# EAGLE schematic sha2017_rev0_1_0_dev (EAGLE 6.6.0)
Assembly variants: PRODUCTION

## Sheet 1 of 5
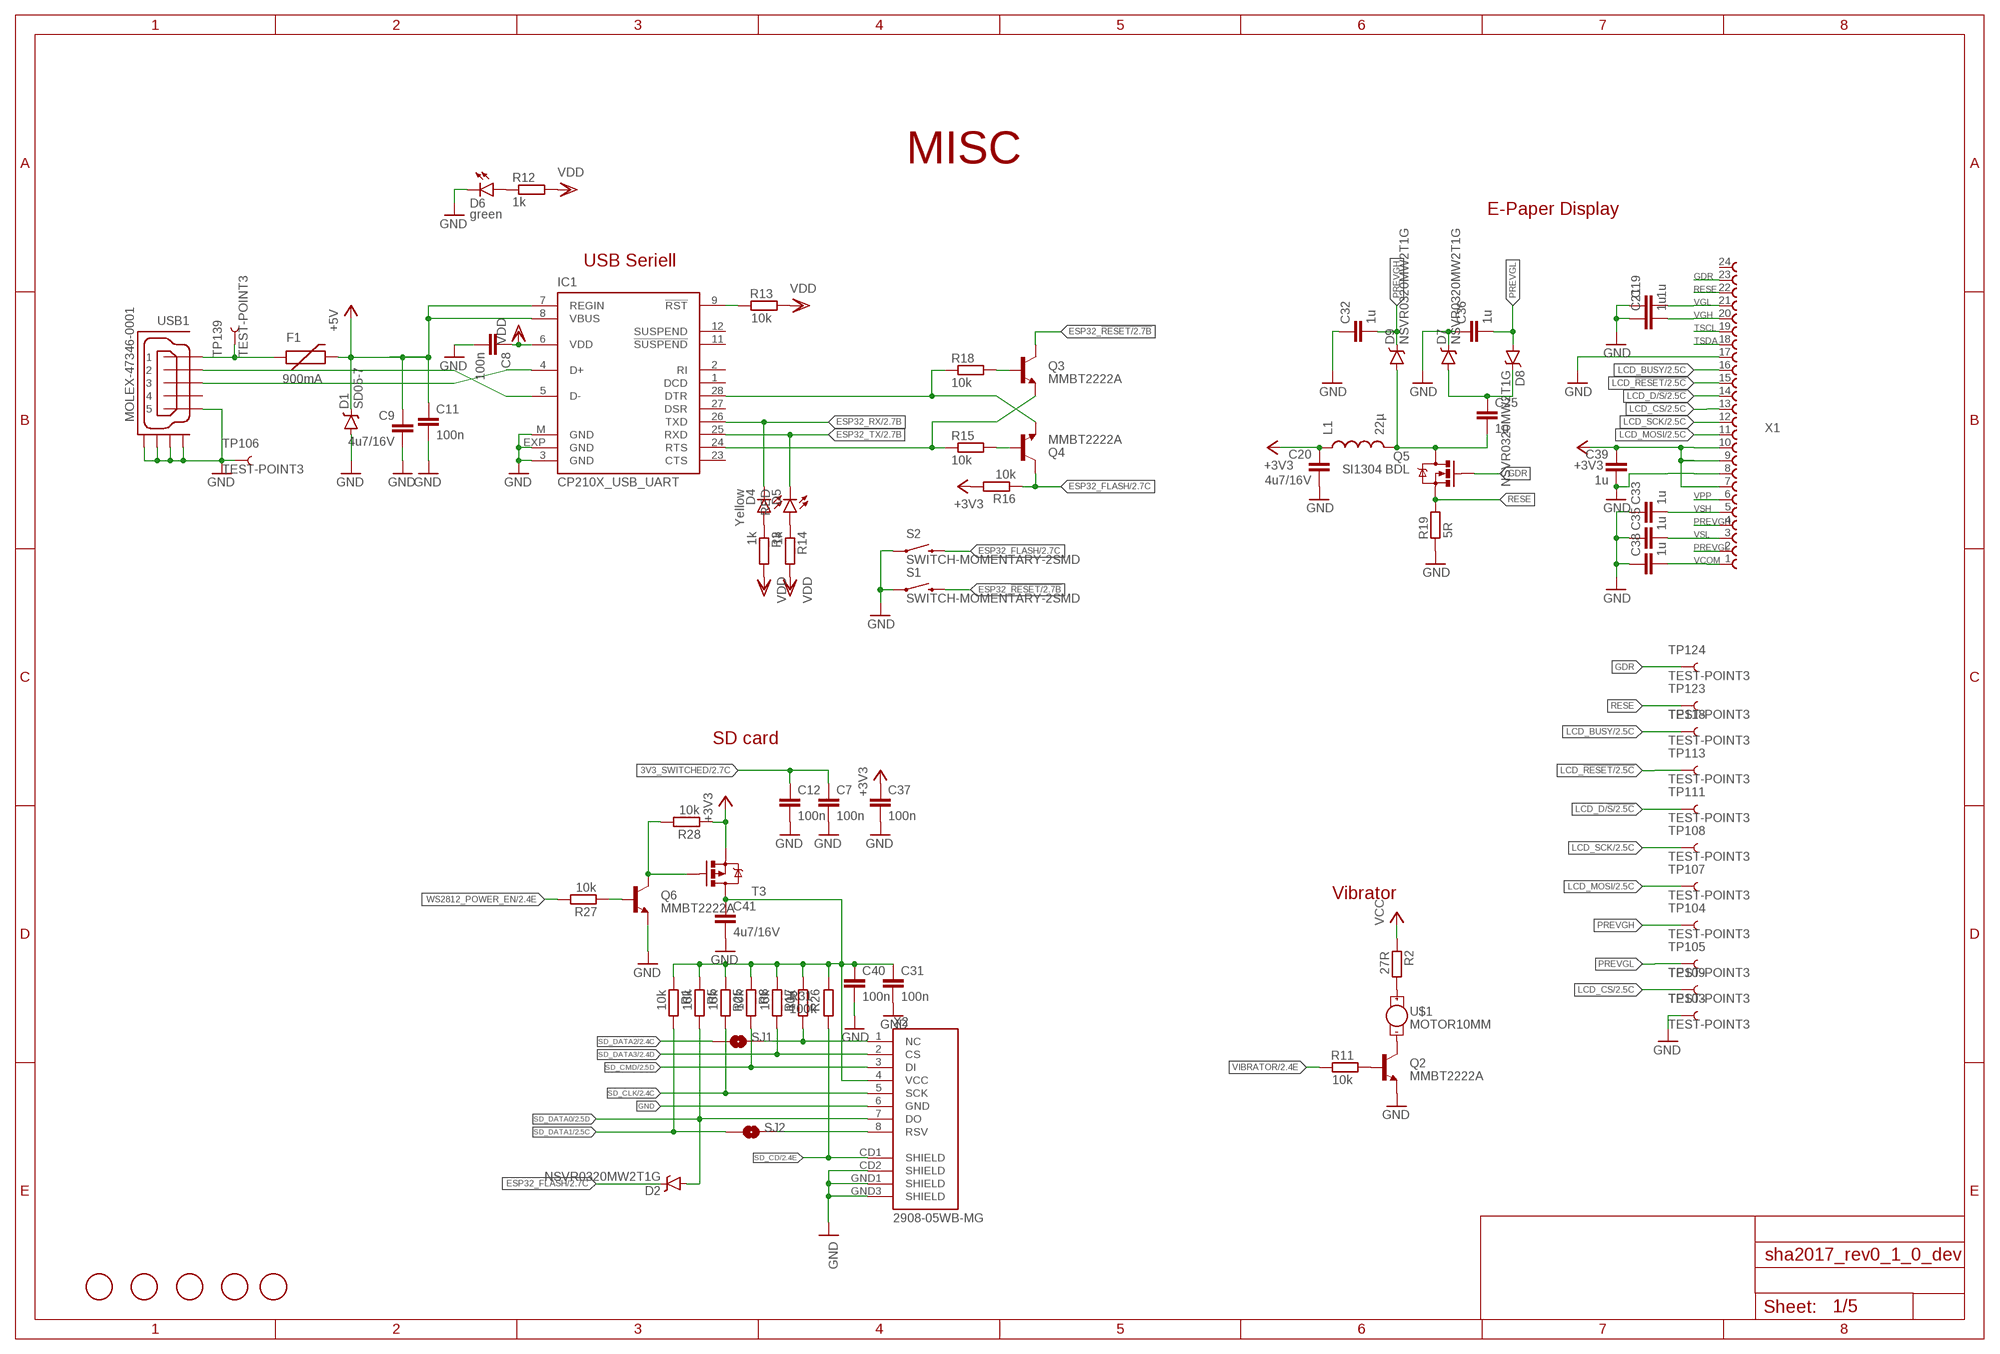
[diagram p0: schematic, sheet 1]

### Parts
C7  100n  C0603-DASHES  [C0603-DASHES]
C8  100n  C0603-DASHES  [C0603-DASHES]
C9  4u7/16V  C-EUC0805  [C0805]
C11  100n  C0603-DASHES  [C0603-DASHES]
C12  100n  C0603-DASHES  [C0603-DASHES]
C19  1u  C0603-DASHES  [C0603-DASHES]
C20  4u7/16V  C-EUC0805  [C0805]
C21  1u  C0603-DASHES  [C0603-DASHES]
C25  1u  C0603-DASHES  [C0603-DASHES]
C31  100n  C0603-DASHES  [C0603-DASHES]
C32  1u  C0603-DASHES  [C0603-DASHES]
C33  1u  C0603-DASHES  [C0603-DASHES]
C35  1u  C0603-DASHES  [C0603-DASHES]
C36  1u  C0603-DASHES  [C0603-DASHES]
C37  100n  C0603-DASHES  [C0603-DASHES]
C38  1u  C0603-DASHES  [C0603-DASHES]
C39  1u  C0603-DASHES  [C0603-DASHES]
C40  100n  C0603-DASHES  [C0603-DASHES]
C41  4u7/16V  C-EUC0805  [C0805]
D1  SD05-7  DIODE-SCHOTTKY-PMEG4005EJ  [SOD-323]
D2  NSVR0320MW2T1G  BAT20JFILM  [SOD-323]
D4  Yellow  LED0603  [LED-0603]
D5  RED  LED0603  [LED-0603]
D6  green  LED0603  [LED-0603]
D7  NSVR0320MW2T1G  BAT20JFILM  [SOD-323]
D8  NSVR0320MW2T1G  BAT20JFILM  [SOD-323]
D9  NSVR0320MW2T1G  BAT20JFILM  [SOD-323]
F1  900mA  PTCSMD  [PTC-1206]
FD1  FIDUCIAL  [FIDUCIAL_1MM]
FD2  FIDUCIAL  [FIDUCIAL_1MM]
FD3  FIDUCIAL  [FIDUCIAL_1MM]
FD4  FIDUCIAL  [FIDUCIAL_1MM]
FD5  FIDUCIAL  [FIDUCIAL_1MM]
IC1  CP210X_USB_UART  [MLP28]
L1  22µ  INDUCTOR1210  [1210]
Q2  MMBT2222A  TRANSISTOR_NPNMMBT2222A  [SOT23-3]
Q3  MMBT2222A  TRANSISTOR_NPNMMBT2222A  [SOT23-3]
Q4  MMBT2222A  TRANSISTOR_NPNMMBT2222A  [SOT23-3]
Q5  SI1304 BDL  MOSFET-NCHANNEL2N7002PW  [SOT323]
Q6  MMBT2222A  TRANSISTOR_NPNMMBT2222A  [SOT23-3]
R1  10k  R0603-DASHES  [R0603-DASHES]
R2  27R  R0603-DASHES  [R0603-DASHES]
R3  1k  R0603-DASHES  [R0603-DASHES]
R5  10k  R0603-DASHES  [R0603-DASHES]
R8  10k  R0603-DASHES  [R0603-DASHES]
R11  10k  R0603-DASHES  [R0603-DASHES]
R12  1k  R0603-DASHES  [R0603-DASHES]
R13  10k  R0603-DASHES  [R0603-DASHES]
R14  1k  R0603-DASHES  [R0603-DASHES]
R15  10k  R0603-DASHES  [R0603-DASHES]
R16  10k  R0603-DASHES  [R0603-DASHES]
R17  10k  R0603-DASHES  [R0603-DASHES]
R18  10k  R0603-DASHES  [R0603-DASHES]
R19  5R  R0603-DASHES  [R0603-DASHES]
R25  10k  R0603-DASHES  [R0603-DASHES]
R26  10k  R0603-DASHES  [R0603-DASHES]
R27  10k  R0603-DASHES  [R0603-DASHES]
R28  10k  R0603-DASHES  [R0603-DASHES]
R31  100k  R0603-DASHES  [R0603-DASHES]
S1  SWITCH-MOMENTARY-2SMD  [TACTILE-SWITCH-SMD]
S2  SWITCH-MOMENTARY-2SMD  [TACTILE-SWITCH-SMD]
SJ1  JUMPER-PAD-2-NOYES_SILK  [PAD-JUMPER-2-NO_YES_SILK]
SJ2  JUMPER-PAD-2-NOYES_SILK  [PAD-JUMPER-2-NO_YES_SILK]
T3  MOSFET-PCHANNEL  [SOT23-3]
TP103  TEST-POINT3  [PAD.03X.03]
TP104  TEST-POINT3  [PAD.03X.03]
TP105  TEST-POINT3  [PAD.03X.03]
TP106  TEST-POINT3  [PAD.03X.03]
TP107  TEST-POINT3  [PAD.03X.03]
TP108  TEST-POINT3  [PAD.03X.03]
TP109  TEST-POINT3  [PAD.03X.03]
TP111  TEST-POINT3  [PAD.03X.03]
TP113  TEST-POINT3  [PAD.03X.03]
TP118  TEST-POINT3  [PAD.03X.03]
TP123  TEST-POINT3  [PAD.03X.03]
TP124  TEST-POINT3  [PAD.03X.03]
TP139  TEST-POINT3  [PAD.03X.03]
U$1  MOTOR10MM  [VIBE-MOTOR-10MM]
USB1  MOLEX-47346-0001  [MOLEX-47364-0001]
X1  68712414022  [68712414022]
X2  2908-05WB-MG  [MICRO-SD-SOCKET-PP]  (not fitted in variant PRODUCTION)

### Nets
3V3_SWITCHED: C7.1 C12.1 C31.1 C40.1 C41.1 R1.2 R5.2 R8.2 R17.2 R25.2 R26.2 R31.1 T3.3(D) X2.4(VCC) ; also sheet 2
+3V3: C20.1 C37.1 C39.1 L1.1 R16.2 R28.2 T3.2(S) X1.7 X1.9 X1.10 ; also sheet 2,3,5
+5V [GND/3V3]: C9.1 C11.1 D1.C F1.2 IC1.7(REGIN) IC1.8(VBUS) ; also sheet 2,3
ESP32_!RESET: Q3.3(C) S1.3 ; also sheet 2
ESP32_FLASH: D2.C Q4.3(C) R16.1 S2.3 ; also sheet 2
ESP32_RX: D4.C IC1.26(TXD) ; also sheet 2
ESP32_TX: D5.C IC1.25(RXD) ; also sheet 2
GDR: Q5.1(G) TP124.P$1 X1.23
GND [GND/3V3]: C7.2 C8.2 C9.2 C11.2 C12.2 C19.1 C20.2 C21.1 C31.2 C32.1 C33.1 C35.1 C36.1 C37.2 C38.1 C39.2 C40.2 C41.2 D1.A D6.C D7.C IC1.3(GND) IC1.EXP(GND) IC1.M(GND) Q2.2(E) Q6.2(E) R19.2 S1.1 S2.1 TP103.P$1 TP106.P$1 USB1.5 USB1.GND1 USB1.GND2 USB1.GND3 USB1.GND4 X1.8 X1.17 X2.6(GND) X2.CD2(SHIELD) X2.GND1(SHIELD) X2.GND3(SHIELD) ; also sheet 2,3,4,5
LCD_!RESET: TP113.P$1 X1.15 ; also sheet 2
LCD_BUSY: TP118.P$1 X1.16 ; also sheet 2
LCD_CS: TP109.P$1 X1.13 ; also sheet 2
LCD_D/!S: TP111.P$1 X1.14 ; also sheet 2
LCD_MOSI: TP107.P$1 X1.11 ; also sheet 2
LCD_SCK: TP108.P$1 X1.12 ; also sheet 2
N$6: SJ2.2 X2.8(RSV)
N$8: IC1.9(!RST) R13.2
N$10: IC1.24(RTS) Q3.2(E) R15.1
N$11: IC1.28(DTR) Q4.2(E) R18.1
N$13: Q4.1(B) R15.2
N$14: Q3.1(B) R18.2
N$15: Q6.1(B) R27.2
N$16: Q2.3(C) U$1.-
N$17: Q6.3(C) R28.1 T3.1(G)
N$18: R2.1 U$1.+
N$22: C25.1 D7.A D8.C
N$23: C25.2 D9.A L1.2 Q5.3(D)
N$26: D6.A R12.1
N$27: D4.A R3.1
N$28: D5.A R14.1
N$32 [GND/3V3]: F1.1 TP139.P$1 USB1.1
N$45: Q2.1(B) R11.1
PREVGH: C32.2 D9.C TP104.P$1 X1.4
PREVGL: C36.2 D8.A TP105.P$1 X1.2
RESE: Q5.2(S) R19.1 TP123.P$1 X1.22
SD_CD: R31.2 X2.CD1(SHIELD) ; also sheet 2
SD_CLK: R25.1 X2.5(SCK) ; also sheet 2
SD_CMD: R8.1 X2.3(DI) ; also sheet 2
SD_DATA0: D2.A R5.1 X2.7(DO) ; also sheet 2
SD_DATA1: R1.1 SJ2.1 ; also sheet 2
SD_DATA2: SJ1.1 ; also sheet 2
SD_DATA2_OUT: R26.1 SJ1.2 X2.1(NC)
SD_DATA3: R17.1 X2.2(CS) ; also sheet 2
TSCL: X1.19
TSDA: X1.18
USB_DN_CON: IC1.5(D-) USB1.2 ; also sheet 2
USB_DP_CON: IC1.4(D+) USB1.3 ; also sheet 2
VCC [FAT]: R2.2 ; also sheet 2,3,4
VCOM: C38.2 X1.1
VDD: C8.1 IC1.6(VDD) R3.2 R12.2 R13.1 R14.2
VGH: C21.2 X1.20
VGL: C19.2 X1.21
VIBRATOR: R11.2 ; also sheet 2
VPP: X1.6
VSH: C33.2 X1.5
VSL: C35.2 X1.3
WS2812_POWER_EN: R27.1 ; also sheet 2,4
Unconnected: IC1.1(DCD) IC1.2(RI) IC1.11(!SUSPEND) IC1.12(SUSPEND) IC1.23(CTS) IC1.27(DSR) USB1.4 X1.24

### Notes on the sheet
- MISC
- E-Paper Display
- USB Seriell
- SD card
- Vibrator

## Sheet 2 of 5
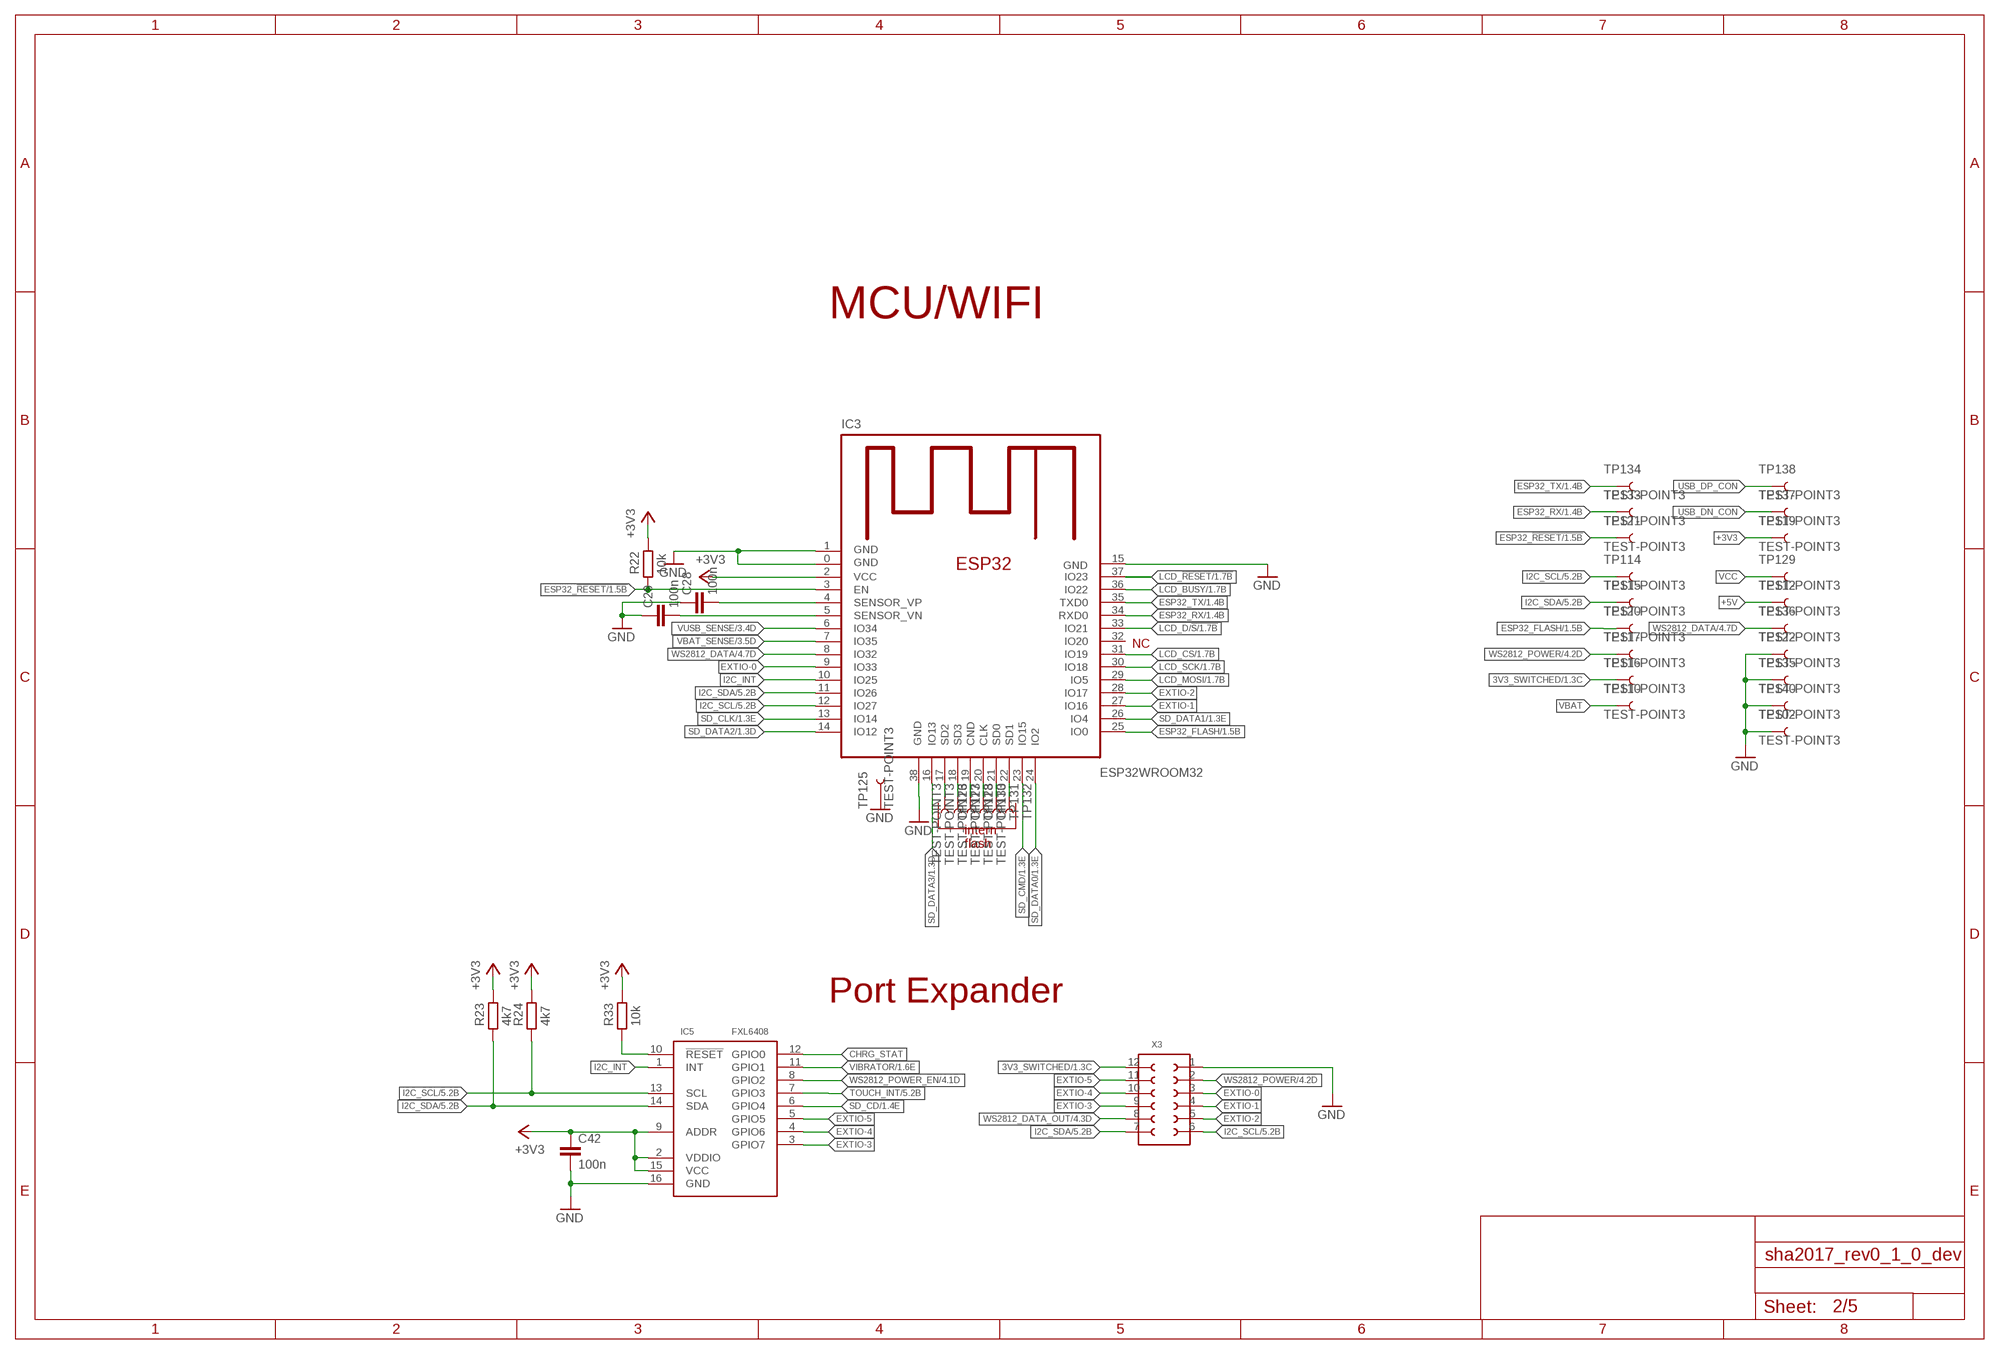
[diagram p1: schematic, sheet 2]

### Parts
C28  100n  C0603-DASHES  [C0603-DASHES]
C29  100n  C0603-DASHES  [C0603-DASHES]
C42  100n  C0603-DASHES  [C0603-DASHES]
IC3  ESP32WROOM32  [ESP32MOD]
IC5  FXL6408  [UMLP-16]
R22  10k  R0603-DASHES  [R0603-DASHES]
R23  4k7  R0603-DASHES  [R0603-DASHES]
R24  4k7  R0603-DASHES  [R0603-DASHES]
R33  10k  R0603-DASHES  [R0603-DASHES]
TP102  TEST-POINT3  [PAD.03X.03]
TP110  TEST-POINT3  [PAD.03X.03]
TP112  TEST-POINT3  [PAD.03X.03]
TP114  TEST-POINT3  [PAD.03X.03]
TP115  TEST-POINT3  [PAD.03X.03]
TP116  TEST-POINT3  [PAD.03X.03]
TP117  TEST-POINT3  [PAD.03X.03]
TP119  TEST-POINT3  [PAD.03X.03]
TP120  TEST-POINT3  [PAD.03X.03]
TP121  TEST-POINT3  [PAD.03X.03]
TP122  TEST-POINT3  [PAD.03X.03]
TP125  TEST-POINT3  [PAD.03X.03]
TP126  TEST-POINT3  [PAD.03X.03]
TP127  TEST-POINT3  [PAD.03X.03]
TP128  TEST-POINT3  [PAD.03X.03]
TP129  TEST-POINT3  [PAD.03X.03]
TP130  TEST-POINT3  [PAD.03X.03]
TP131  TEST-POINT3  [PAD.03X.03]
TP132  TEST-POINT3  [PAD.03X.03]
TP133  TEST-POINT3  [PAD.03X.03]
TP134  TEST-POINT3  [PAD.03X.03]
TP135  TEST-POINT3  [PAD.03X.03]
TP136  TEST-POINT3  [PAD.03X.03]
TP137  TEST-POINT3  [PAD.03X.03]
TP138  TEST-POINT3  [PAD.03X.03]
TP140  TEST-POINT3  [PAD.03X.03]
X3  610X12243021  [610X12243021]

### Nets
3V3_SWITCHED: TP116.P$1 X3.12 ; also sheet 1
+3V3: C42.1 IC3.2(VCC) IC5.2(VDDIO) IC5.9(ADDR) IC5.15(VCC) R22.1 R23.1 R24.1 R33.1 TP119.P$1 ; also sheet 1,3,5
+5V [GND/3V3]: TP112.P$1 ; also sheet 1,3
CD0: IC3.21(SD0) TP131.P$1
CHRG_STAT: IC5.12(GPIO0) ; also sheet 3
CLK: IC3.20(CLK) TP130.P$1
CND: IC3.19(CND) TP128.P$1
ESP32_!RESET: IC3.3(EN) R22.2 TP121.P$1 ; also sheet 1
ESP32_FLASH: IC3.25(IO0) TP120.P$1 ; also sheet 1
ESP32_RX: IC3.34(RXD0) TP133.P$1 ; also sheet 1
ESP32_TX: IC3.35(TXD0) TP134.P$1 ; also sheet 1
EXTIO-0: IC3.9(IO33) X3.3
EXTIO-1: IC3.27(IO16) X3.4
EXTIO-2: IC3.28(IO17) X3.5
EXTIO-3: IC5.3(GPIO7) X3.9
EXTIO-4: IC5.4(GPIO6) X3.10
EXTIO-5: IC5.5(GPIO5) X3.11
GND [GND/3V3]: C28.1 C29.1 C42.2 IC3.0(GND) IC3.1(GND) IC3.15(GND) IC3.38(GND) IC5.16(GND) TP102.P$1 TP122.P$1 TP125.P$1 TP135.P$1 TP140.P$1 X3.1 ; also sheet 1,3,4,5
I2C_INT: IC3.10(IO25) IC5.1(INT)
I2C_SCL: IC3.12(IO27) IC5.13(SCL) R24.2 TP114.P$1 X3.6 ; also sheet 5
I2C_SDA: IC3.11(IO26) IC5.14(SDA) R23.2 TP115.P$1 X3.7 ; also sheet 5
LCD_!RESET: IC3.37(IO23) ; also sheet 1
LCD_BUSY: IC3.36(IO22) ; also sheet 1
LCD_CS: IC3.31(IO19) ; also sheet 1
LCD_D/!S: IC3.33(IO21) ; also sheet 1
LCD_MOSI: IC3.29(IO5) ; also sheet 1
LCD_SCK: IC3.30(IO18) ; also sheet 1
N$42: C28.2 IC3.4(SENSOR_VP)
N$43: C29.2 IC3.5(SENSOR_VN)
N$59: IC5.10(!RESET) R33.2
SD1: IC3.22(SD1) TP132.P$1
SD2: IC3.17(SD2) TP126.P$1
SD3: IC3.18(SD3) TP127.P$1
SD_CD: IC5.6(GPIO4) ; also sheet 1
SD_CLK: IC3.13(IO14) ; also sheet 1
SD_CMD: IC3.23(IO15) ; also sheet 1
SD_DATA0: IC3.24(IO2) ; also sheet 1
SD_DATA1: IC3.26(IO4) ; also sheet 1
SD_DATA2: IC3.14(IO12) ; also sheet 1
SD_DATA3: IC3.16(IO13) ; also sheet 1
TOUCH_INT: IC5.7(GPIO3) ; also sheet 5
USB_DN_CON: TP137.P$1 ; also sheet 1
USB_DP_CON: TP138.P$1 ; also sheet 1
VBAT [FAT]: TP110.P$1 ; also sheet 3
VBAT_SENSE: IC3.7(IO35) ; also sheet 3
VCC [FAT]: TP129.P$1 ; also sheet 1,3,4
VIBRATOR: IC5.11(GPIO1) ; also sheet 1
VUSB_SENSE: IC3.6(IO34) ; also sheet 3
WS2812_DATA: IC3.8(IO32) TP136.P$1 ; also sheet 4
WS2812_DATA_OUT: X3.8 ; also sheet 4
WS2812_POWER: TP117.P$1 X3.2 ; also sheet 4
WS2812_POWER_EN: IC5.8(GPIO2) ; also sheet 1,4
Unconnected: IC3.32(IO20)

### Notes on the sheet
- MCU/WIFI
- NC
- intern
  flash
- Port Expander

## Sheet 3 of 5
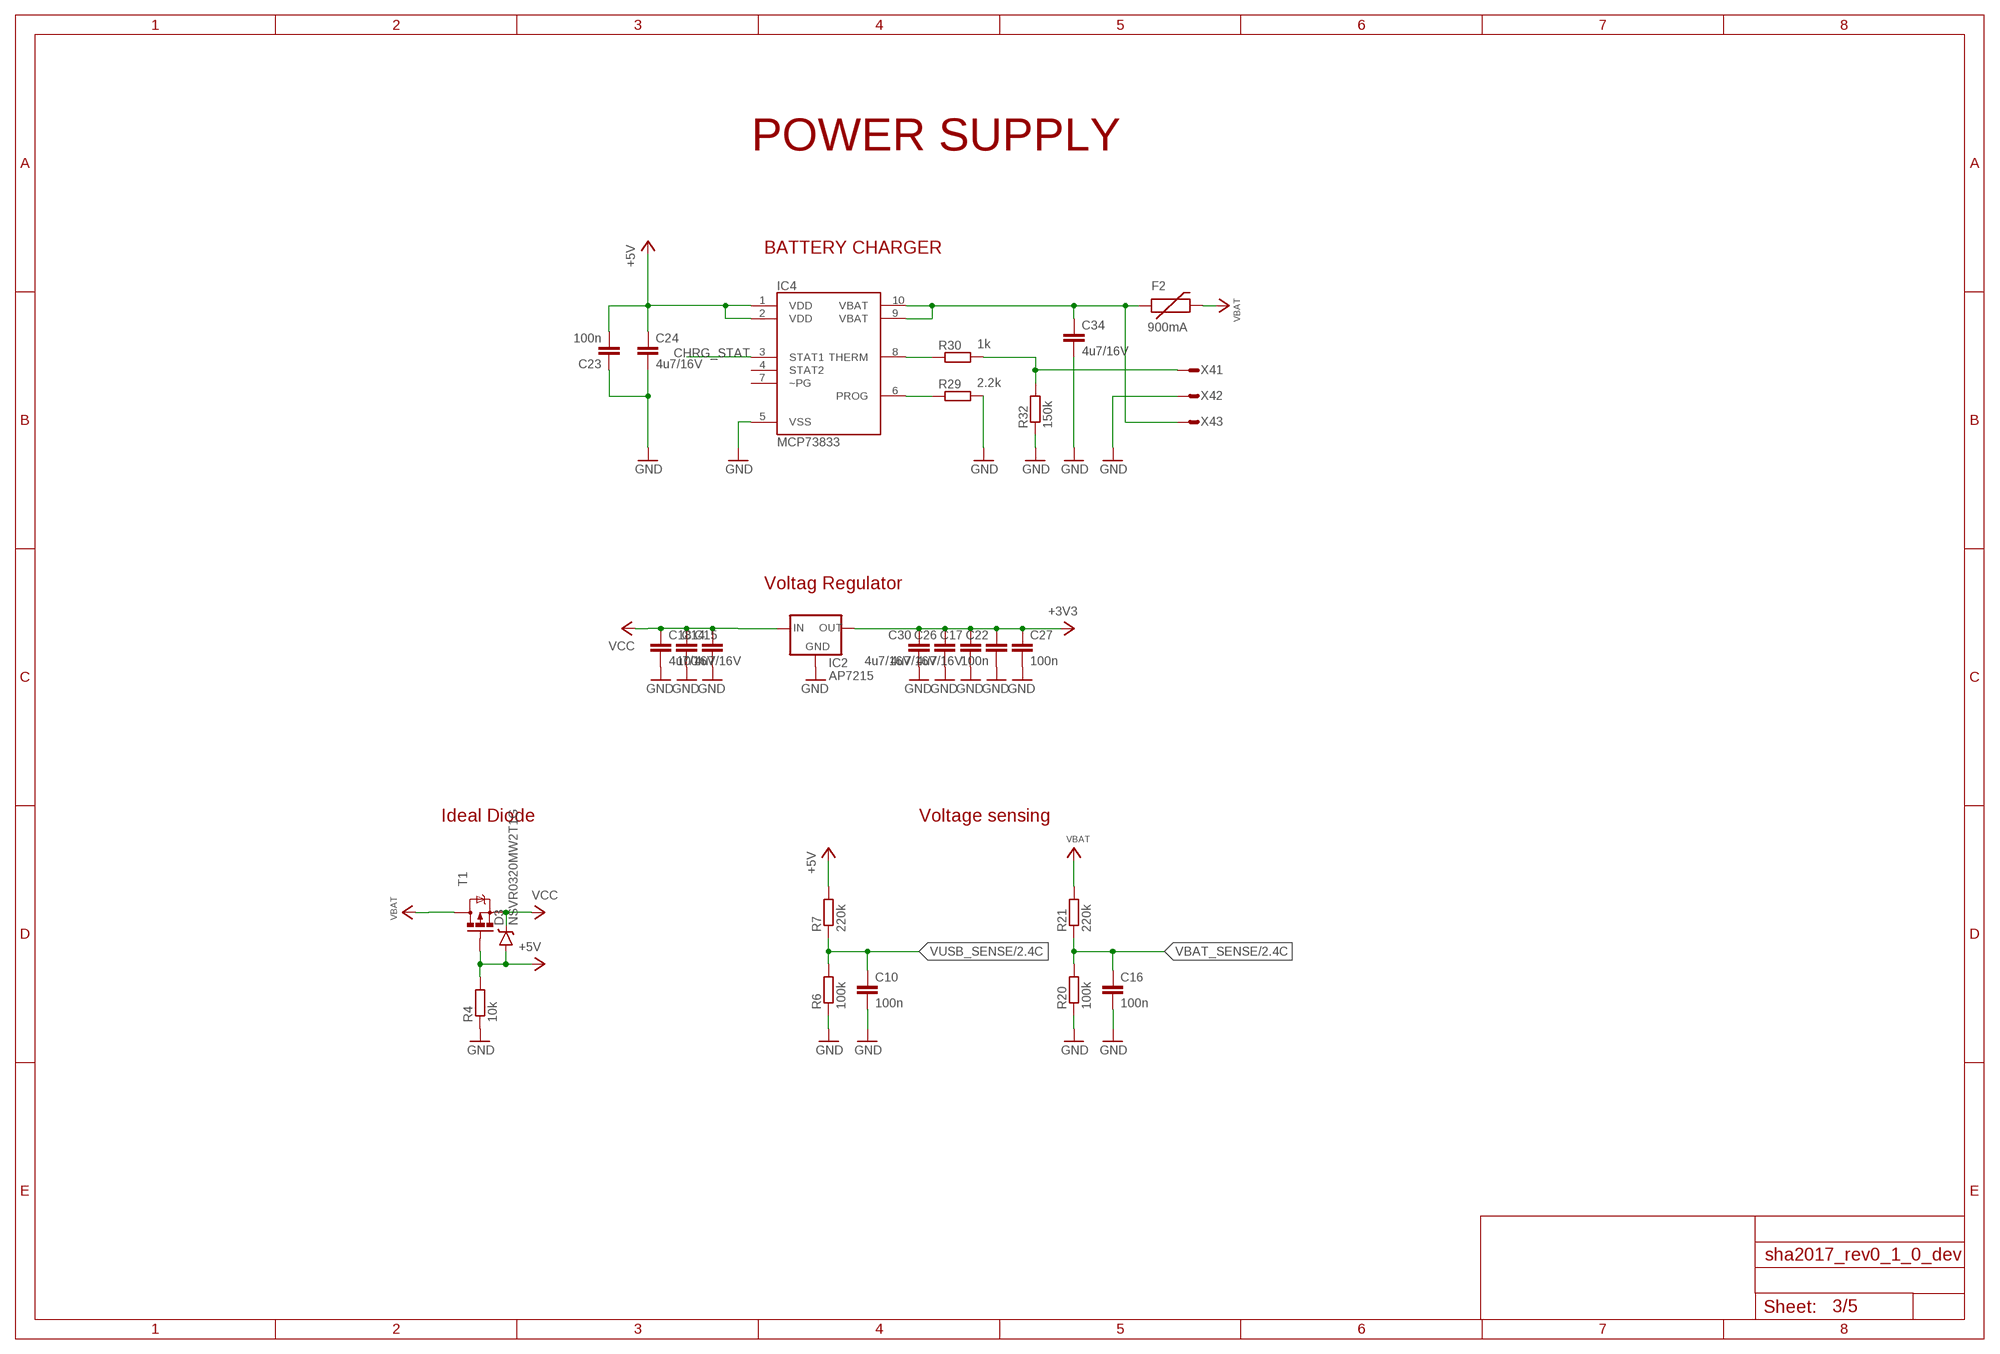
[diagram p2: schematic, sheet 3]

### Parts
C10  100n  C0603-DASHES  [C0603-DASHES]
C14  100n  C0603-DASHES  [C0603-DASHES]
C15  4u7/16V  C-EUC0805  [C0805]
C16  100n  C0603-DASHES  [C0603-DASHES]
C17  4u7/16V  C-EUC0805  [C0805]
C18  4u7/16V  C-EUC0805  [C0805]
C22  100n  C0603-DASHES  [C0603-DASHES]
C23  100n  C0603-DASHES  [C0603-DASHES]
C24  4u7/16V  C-EUC0805  [C0805]
C26  4u7/16V  C-EUC0805  [C0805]
C27  100n  C0603-DASHES  [C0603-DASHES]
C30  4u7/16V  C-EUC0805  [C0805]
C34  4u7/16V  C-EUC0805  [C0805]
D3  NSVR0320MW2T1G  BAT20JFILM  [SOD-323]
F2  900mA  PTCSMD  [PTC-1206]
IC2  AP7215  [SOT89]
IC4  MCP73833  [MSOP-10]
R4  10k  R0603-DASHES  [R0603-DASHES]
R6  100k  R0603-DASHES  [R0603-DASHES]
R7  220k  R0603-DASHES  [R0603-DASHES]
R20  100k  R0603-DASHES  [R0603-DASHES]
R21  220k  R0603-DASHES  [R0603-DASHES]
R29  2.2k  R0603-DASHES  [R0603-DASHES]
R30  1k  R0603-DASHES  [R0603-DASHES]
R32  150k  R0603-DASHES  [R0603-DASHES]
T1  MOSFET-PCHANNEL  [SOT23-3]
X4  JST-PH3  [JST-PH3]

### Nets
+3V3: C17.1 C22.1 C26.1 C27.1 C30.1 IC2.3(OUT) ; also sheet 1,2,5
+5V [GND/3V3]: C23.2 C24.1 D3.A IC4.1(VDD) IC4.2(VDD) R4.2 R7.2 T1.1(G) ; also sheet 1,2
CHRG_STAT: IC4.3(STAT1) ; also sheet 2
GND [GND/3V3]: C10.2 C14.2 C15.2 C16.2 C17.2 C18.2 C22.2 C23.1 C24.2 C26.2 C27.2 C30.2 C34.2 IC2.1(GND) IC4.5(VSS) R4.1 R6.1 R20.1 R29.1 R32.1 X4.2 ; also sheet 1,2,4,5
N$46: IC4.6(PROG) R29.2
N$47: IC4.8(THERM) R30.2
N$48: R30.1 R32.2 X4.1
N$49 [FAT]: C34.1 F2.1 IC4.9(VBAT) IC4.10(VBAT) X4.3
VBAT [FAT]: F2.2 R21.2 T1.3(D) ; also sheet 2
VBAT_SENSE: C16.1 R20.2 R21.1 ; also sheet 2
VCC [FAT]: C14.1 C15.1 C18.1 D3.C IC2.2(IN) IC2.2@(IN) T1.2(S) ; also sheet 1,2,4
VUSB_SENSE: C10.1 R6.2 R7.1 ; also sheet 2
Unconnected: IC4.4(STAT2) IC4.7(~PG)

### Notes on the sheet
- POWER SUPPLY
- BATTERY CHARGER
- Voltag Regulator
- Ideal Diode | Voltage sensing

## Sheet 4 of 5
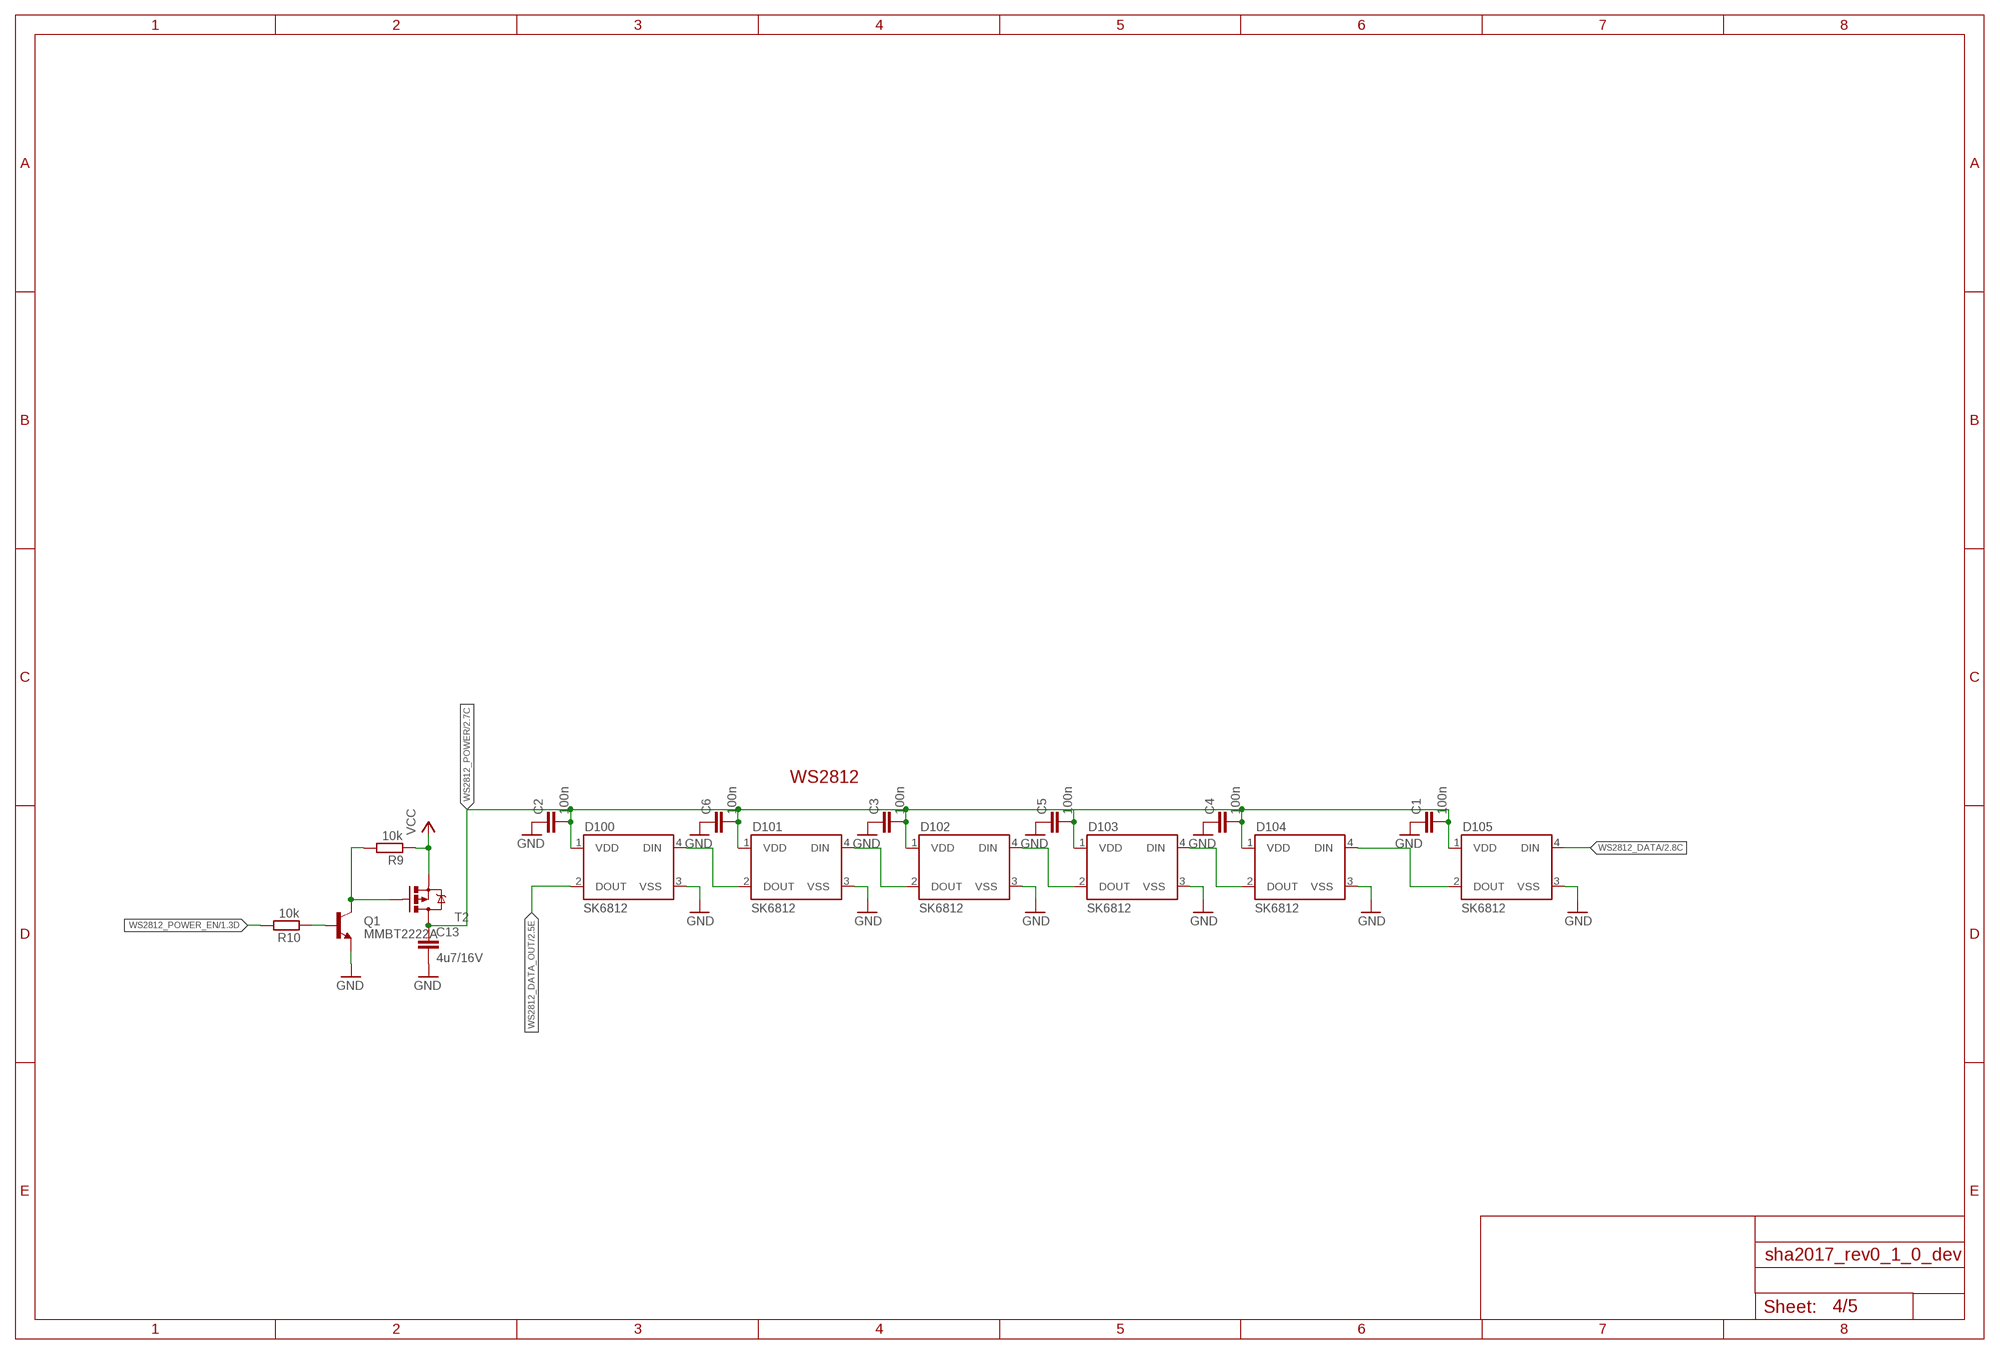
[diagram p3: schematic, sheet 4]

### Parts
C1  100n  C0603-DASHES  [C0603-DASHES]
C2  100n  C0603-DASHES  [C0603-DASHES]
C3  100n  C0603-DASHES  [C0603-DASHES]
C4  100n  C0603-DASHES  [C0603-DASHES]
C5  100n  C0603-DASHES  [C0603-DASHES]
C6  100n  C0603-DASHES  [C0603-DASHES]
C13  4u7/16V  C-EUC0805  [C0805]
D100  SK6812  WS2812B  [WS2812B]
D101  SK6812  WS2812B  [WS2812B]
D102  SK6812  WS2812B  [WS2812B]
D103  SK6812  WS2812B  [WS2812B]
D104  SK6812  WS2812B  [WS2812B]
D105  SK6812  WS2812B  [WS2812B]
Q1  MMBT2222A  TRANSISTOR_NPNMMBT2222A  [SOT23-3]
R9  10k  R0603-DASHES  [R0603-DASHES]
R10  10k  R0603-DASHES  [R0603-DASHES]
T2  MOSFET-PCHANNEL  [SOT23-3]

### Nets
GND [GND/3V3]: C1.1 C2.1 C3.1 C4.1 C5.1 C6.1 C13.2 D100.3(VSS) D101.3(VSS) D102.3(VSS) D103.3(VSS) D104.3(VSS) D105.3(VSS) Q1.2(E) ; also sheet 1,2,3,5
N$2: D100.4(DIN) D101.2(DOUT)
N$3: D103.4(DIN) D104.2(DOUT)
N$4: D104.4(DIN) D105.2(DOUT)
N$19: D101.4(DIN) D102.2(DOUT)
N$50: D102.4(DIN) D103.2(DOUT)
N$52: Q1.1(B) R10.2
N$53: Q1.3(C) R9.1 T2.1(G)
VCC [FAT]: R9.2 T2.2(S) ; also sheet 1,2,3
WS2812_DATA: D105.4(DIN) ; also sheet 2
WS2812_DATA_OUT: D100.2(DOUT) ; also sheet 2
WS2812_POWER: C1.2 C2.2 C3.2 C4.2 C5.2 C6.2 C13.1 D100.1(VDD) D101.1(VDD) D102.1(VDD) D103.1(VDD) D104.1(VDD) D105.1(VDD) T2.3(D) ; also sheet 2
WS2812_POWER_EN: R10.1 ; also sheet 1,2

### Notes on the sheet
- WS2812

## Sheet 5 of 5
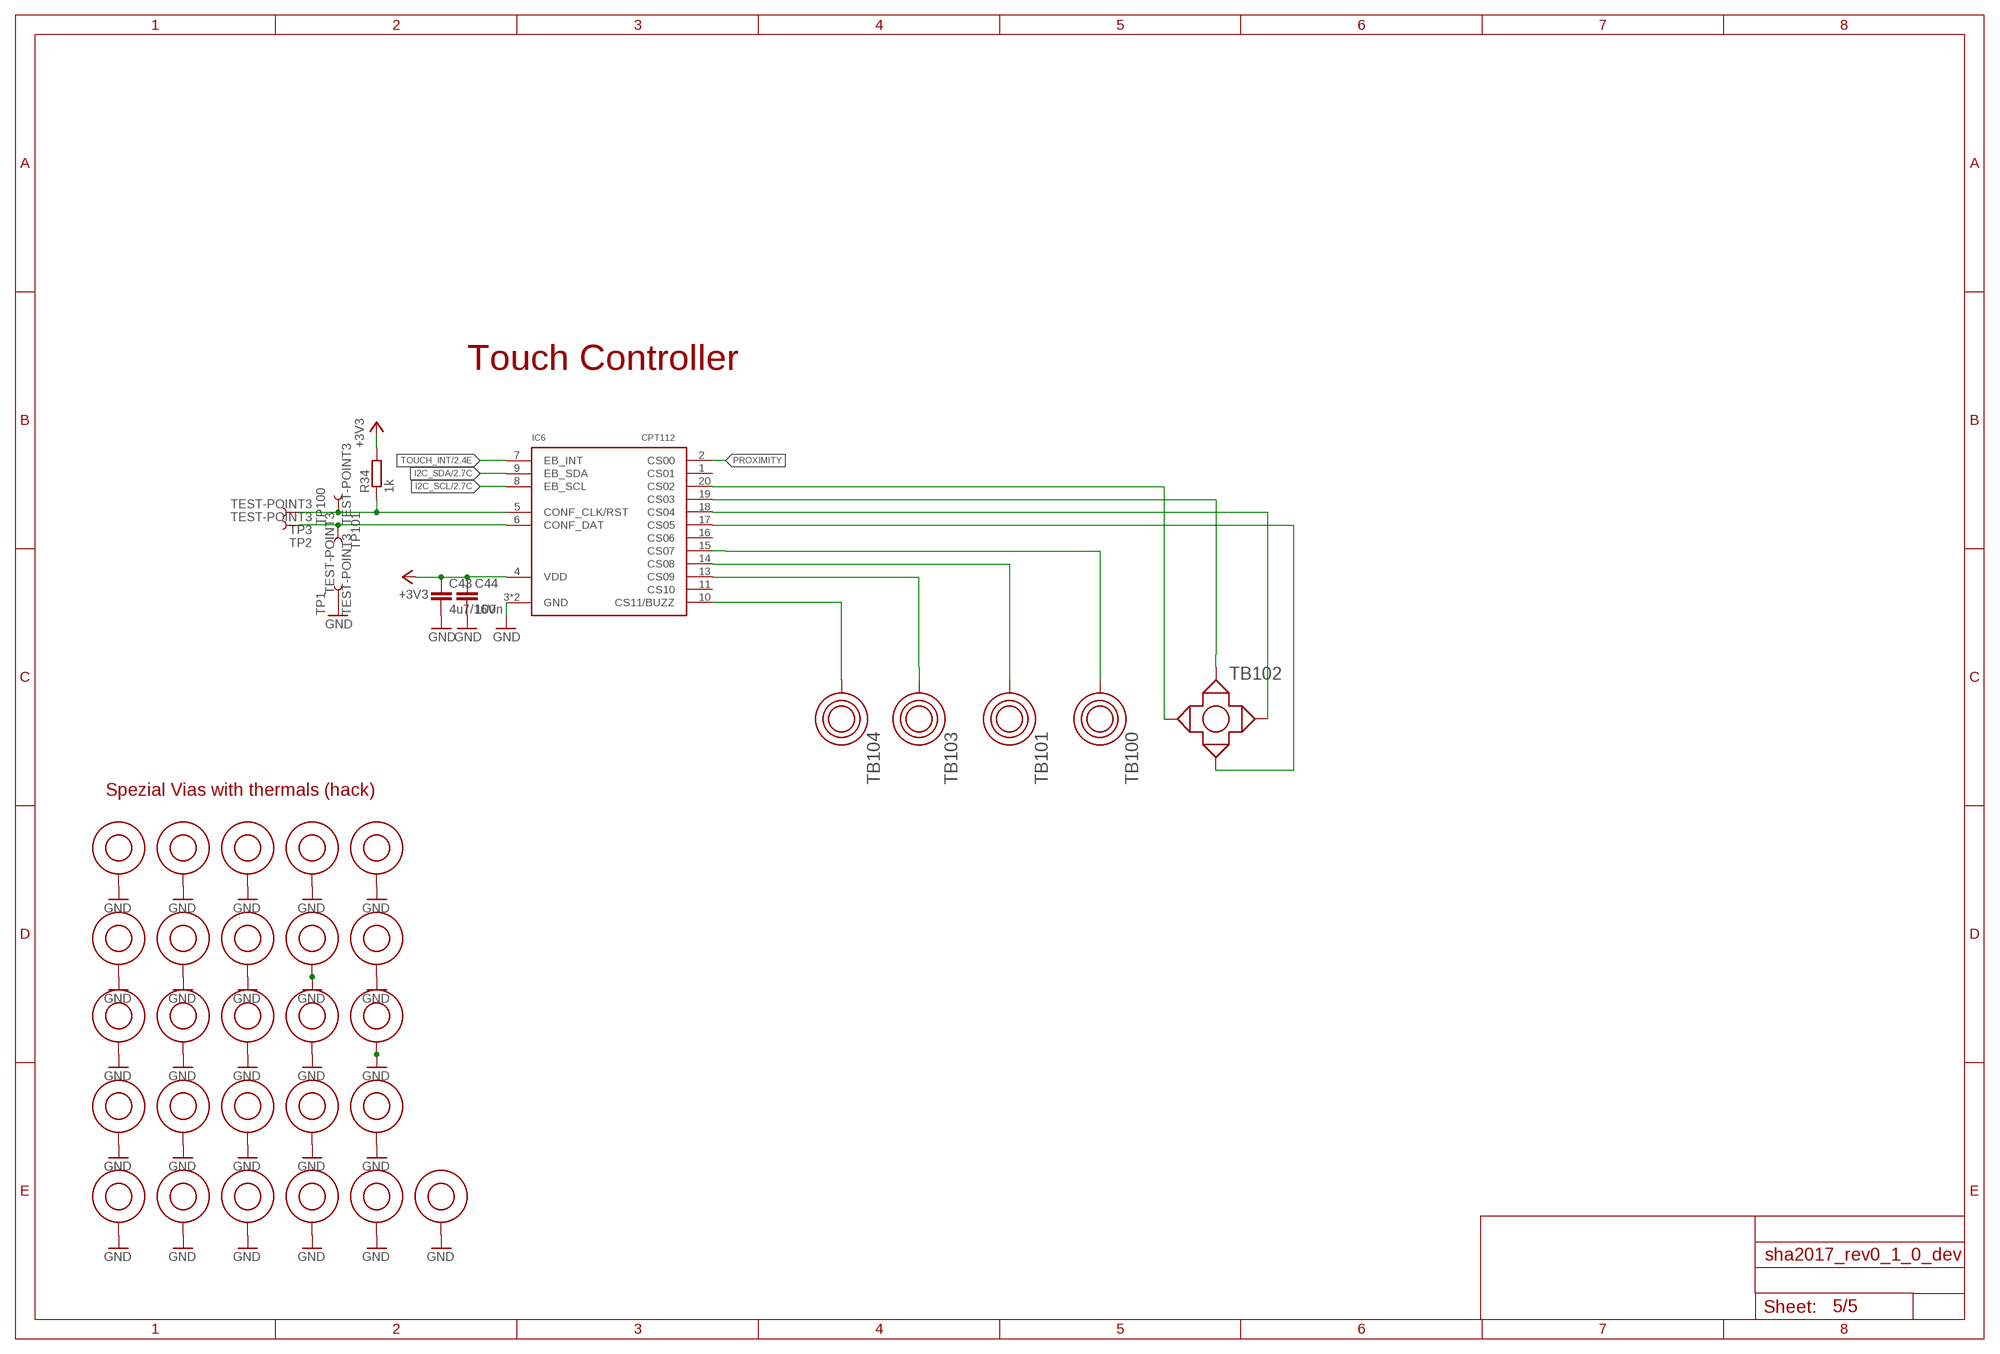
[diagram p4: schematic, sheet 5]

### Parts
$$U$1  VIA  [VIA]
$$U$2  VIA  [VIA]
$$U$3  VIA  [VIA]
$$U$4  VIA  [VIA]
$$U$5  VIA  [VIA]
$$U$6  VIA  [VIA]
$$U$7  VIA  [VIA]
$$U$8  VIA  [VIA]
$$U$9  VIA  [VIA]
C43  4u7/16V  C-EUC0805  [C0805]
C44  100n  C0603-DASHES  [C0603-DASHES]
IC6  CPT112  [QFN20-3X3MM]
R34  1k  R0603-DASHES  [R0603-DASHES]
TB100  TOUCHSELECT  [TOUCH_SELECT]
TB101  TOUCHSELECT  [TOUCH_SELECT]
TB102  TOUCH_CROSS  [TOUCH_CROSS]
TB103  TOUCHROUND  [TOUCH_BUTTON]
TB104  TOUCHROUND  [TOUCH_BUTTON]
TP1  TEST-POINT3  [PAD.03X.03]
TP2  TEST-POINT3  [PAD.03X.03]
TP3  TEST-POINT3  [PAD.03X.03]
TP100  TEST-POINT3  [PAD.03X.03]
TP101  TEST-POINT3  [PAD.03X.03]
U$2  VIA  [VIA]
U$3  VIA  [VIA]
U$4  VIA  [VIA]
U$5  VIA  [VIA]
U$6  VIA  [VIA]
U$10  VIA  [VIA]
U$11  VIA  [VIA]
U$12  VIA  [VIA]
U$13  VIA  [VIA]
U$14  VIA  [VIA]
U$15  VIA  [VIA]
U$16  VIA  [VIA]
U$17  VIA  [VIA]
U$18  VIA  [VIA]
U$19  VIA  [VIA]
U$20  VIA  [VIA]
U$21  VIA  [VIA]
U$22  VIA  [VIA]
U$23  VIA  [VIA]

### Nets
+3V3: C43.1 C44.1 IC6.4(VDD) R34.2 ; also sheet 1,2,3
GND [GND/3V3]: $$U$1.P$1 $$U$2.P$1 $$U$3.P$1 $$U$4.P$1 $$U$5.P$1 $$U$6.P$1 $$U$7.P$1 $$U$8.P$1 $$U$9.P$1 C43.2 C44.2 IC6.3(GND) IC6.12(GND) TP1.P$1 U$2.P$1 U$3.P$1 U$4.P$1 U$5.P$1 U$6.P$1 U$10.P$1 U$11.P$1 U$12.P$1 U$13.P$1 U$14.P$1 U$15.P$1 U$16.P$1 U$17.P$1 U$18.P$1 U$19.P$1 U$20.P$1 U$21.P$1 U$22.P$1 U$23.P$1 ; also sheet 1,2,3,4
I2C_SCL: IC6.8(EB_SCL) ; also sheet 2
I2C_SDA: IC6.9(EB_SDA) ; also sheet 2
N$1 [Touch]: IC6.10(CS11/BUZZ) TB104.P$1
N$25 [Touch]: IC6.20(CS02) TB102.L(LEFT)
N$55 [Touch]: IC6.19(CS03) TB102.UP
N$56 [Touch]: IC6.18(CS04) TB102.R(RIGHT)
N$57 [Touch]: IC6.17(CS05) TB102.D(DOWN)
N$58 [Touch]: IC6.13(CS09) TB103.P$1
N$61: IC6.5(CONF_CLK/RST) R34.1 TP3.P$1 TP100.P$1
N$62: IC6.6(CONF_DAT) TP2.P$1 TP101.P$1
N$64 [Touch]: IC6.14(CS08) TB101.P$1
N$65 [Touch]: IC6.15(CS07) TB100.P$1
PROXIMITY [touch prox]: IC6.2(CS00)
TOUCH_INT: IC6.7(EB_INT) ; also sheet 2
Unconnected: IC6.1(CS01) IC6.11(CS10) IC6.16(CS06)

### Notes on the sheet
- Touch Controller
- Spezial Vias with thermals (hack)

## Library data of the parts
$$U$1-$$U$9 U$2-U$6 U$10-U$23 = badge:VIA; PARTNO: NAP
C1-C8 C11 C12 C14 C22 C23 C27 C31 C37 C40 C44 = sha2017_rev0_1_0_dev:C0603-DASHES; PARTNO: GRM188R71H104KA93D
C9 C13 C15 C17 C18 C20 C24 C26 C30 C34 C41 C43 = rcl:C-EU: CAPACITOR, European symbol; PARTNO: GRM21BR61C475KA88K
C10 C16 C28 C29 C42 = sha2017_rev0_1_0_dev:C0603-DASHES; OC_FARNELL: unknown; PARTNO: GRM188R71H104KA93D
C19 C21 C25 C32 C33 C35 C36 C38 C39 = sha2017_rev0_1_0_dev:C0603-DASHES; PARTNO: GRM188R61E105KA12D
D1 = SparkFun-DiscreteSemi:DIODE-SCHOTTKY: Schottky diodes in SFE's production catalog BAT20J 1A 23V 0.62Vf RB751 120mA 40V 0.37Vf PMEG4005EJ 0.5A 40V 0.42Vf MBRA140 1A 40V 0.5Vf B340A 3A 40V SMA; PARTNO: SD05-7; PROD_ID: DIO-10955; VALUE: PMEG4005EJ
D2 D3 D7-D9 = SparkFun-DiscreteSemi:BAT20JFILM: 23V, 1A Schottky diode, SOD-323 package; PARTNO: BAT20JFILM; PROD_ID: DIO-11623; VALUE: BAT20JFILM
D4-D6 = SparkFun-LED:LED: LEDs Standard schematic elements and footprints for 5mm, 3mm, 1206, and 0603 sized LEDs. 5mm - Spark Fun Electronics SKU : COM-00529 (and others)
D100-D105 = SparkFun-LED:WS2812B: WS2812B - Intelligent control LED integrated light source Technical Specifications: Power Supply Voltage (VDD): 3.5 to 5.3 V Input Voltage (VI): -0.5 to VDD+0.5 V Operating Junction Temperature (Topt): -25°C to +80°C Storage Temperature Range (Tstg): -55°C to +150°C; PARTNO: SK6812
F1 F2 = SparkFun-PowerIC:PTC: Resettable Fuse PTC Resettable Fuse. Spark Fun Electronics SKU : COM-08357; PROD_ID: RES-11150
FD1-FD5 = adafruit:FIDUCIAL: For use by pick and place machines to calibrate the vision/machine, 1mm By microbuilder.eu; OC_FARNELL: unknown; PARTNO: NAP
IC1 = SparkFun-DigitalIC:CP210X_USB_UART: Single-Chip USB to UART Bridge Source: www.silabs.com .. CP2101.pdf / cp2102.pdf. Spark Fun Electronics SKU : COM-00310; PARTNO: CP2102-GMR
IC2 = badge:AP7215; PARTNO: AP7215-33YG-13
IC3 = ESP3x:ESP32WROOM32
IC4 = SparkFun:MCP73833: Microchip MCP73833 Stand-alone Linear Li-ion/Li-polymer Charge Management Controller Packages: DFN-10, MSOP-10 Last modified: 8/17/10 Unproven!; PARTNO: MCP73833-BZI/UN
IC5 = badge:FXL6408; PARTNO: FXL6408UMX
IC6 = badge:CPT112; PARTNO: CPT112S-A02-GM
L1 = SparkFun-Passives:INDUCTOR: Inductors Basic Inductor/Choke - 0603 and 1206. Footprints are not proven and vary greatly between part numbers. SRN6045- 33uH, 20% 1.4A SDR0403-560KL - 56uH, 10%, 500mA RMS/740mA peak; PARTNO: NLCV32T-220K-EF
Q1-Q4 Q6 = SparkFun-DiscreteSemi:TRANSISTOR_NPN: Generic NPN BJT MMBT2222A - TRANS-08049 (SOT-23, 1A 40V) MPSA42 - TRANS-09116 (SOT-23, 500mA 300V) MMBT5088LT1G - TRANS-11160 (SOT-23, 50 mA 30V) BC547 - COM-08928 <http://www.sparkfun.com/products/8928> (TO-92 45V 100mA) (1.Collector 2.Base 3.Emitter) 2N3904 - COM-00521 <http://www.sparkfun.com/products/521> (TO-92 40V 200mA) (1.Emitter 2.Base 3.Collector) P2N2222A - COM-12852 <http://www.sparkfun.com/products/12852> (TO-92 40V 600mA) (1.Collector 2.Base 3.Emitter); PARTNO: BC817-25,215; PROD_ID: TRANS-08049
Q5 = SparkFun-DiscreteSemi:MOSFET-NCHANNEL: Common NMOSFET Parts MFG P/N Store ID Prod ID FDD8780 TRANS-09984 SI7820DN TRANS-11055 FDS6630A IC-08089 2N7002PW TRANS-11151 FQP30N06L COM-10213 TRANS-10060 BSS123LT1G TRANS-08345 BSS138 TRANS-00830 BS170 2N7000; PARTNO: SI1308EDL-T1-GE3; PROD_ID: TRANS-11151
R1 R5 R8-R11 R27 R28 = 00ralf:R0603-DASHES; PARTNO: ERJ-3GEYJ103V
R2 = 00ralf:R0603-DASHES; PARTNO: ERJ-3GEYJ220V
R3 R12 R14 R30 R34 = sha2017_rev0_1_0_dev:R0603-DASHES; PARTNO: ERJ-3GEYJ102V
R4 R13 R15-R18 R25 R26 = sha2017_rev0_1_0_dev:R0603-DASHES; PARTNO: ERJ-3GEYJ103V
R6 R20 R31 = sha2017_rev0_1_0_dev:R0603-DASHES; PARTNO: ERJ-3GEYJ104V
R7 R21 = sha2017_rev0_1_0_dev:R0603-DASHES; PARTNO: ERJ-3GEYJ224V
R19 = sha2017_rev0_1_0_dev:R0603-DASHES; PARTNO: ERJ-3GEYJ5R1V
R22-R24 R33 = sha2017_rev0_1_0_dev:R0603-DASHES; OC_FARNELL: unknown; PARTNO: ERJ-3GEYJ103V
R29 = sha2017_rev0_1_0_dev:R0603-DASHES; PARTNO: ERJ-3GEYJ222V
R32 = sha2017_rev0_1_0_dev:R0603-DASHES; PARTNO: ERJ-3GEYJ154V
S1 S2 = SparkFun-Electromechanical:SWITCH-MOMENTARY-2: Various NO switches- pushbuttons, reed, etc; PARTNO: SKQGABE010; PROD_ID: SWCH-08247
SJ1 SJ2 = SparkFun-Passives:JUMPER-PAD-2-NO; PARTNO: NAP
T1-T3 = SparkFun-DiscreteSemi:MOSFET-PCHANNEL: Generic PMOSFET IRLML2244 - TRANS-11153 (SOT-23 -20V -4.3A) (1.Gate 2.Source 3.Drain) FQP27P06 - COM-10349 <http://www.sparkfun.com/products/10349> (TO-220 -60V -27A) (1.Gate 2.Source 3.Drain); PROD_ID: TRANS-08285
TB100 TB101 TB103 TB104 = badge:TOUCH; PARTNO: NAP
TB102 = badge:TOUCH_CROSS; PARTNO: NAP
TP1-TP3 TP100-TP140 = SparkFun-Passives:TEST-POINT: Bare copper test points for troubleshooting or ICT; PARTNO: NAP
U$1 = badge:MOTOR: Vibration Motor- ROB-08449 Physical dimension and wire connections for this powerful vibration motor. Motor has a self adhesive backing.
USB1 = usb_con-update:MOLEX-47346-0001: MICRO USB B, BOTTOM MOUNT; PARTNO: 10118192-0001LF
X1 = EAGLE-FPC_CONNECTOR_AND_FFC_CAB-rev1:68712414022: WR-FPC 0.5mm SMT ZIF Horizontal Top Contact, 24 Pins=>Code : Con_FPC_ZIF_0.50_68712414022 <http://katalog.we-online.de/media/images/eican/Con_FPC_ZIF_0.50_6871xx14022_pf2.jpg> Details see: http://katalog.we-online.de/en/em/687_1xx_140_22 Created 2014-07-09, Karrer Zheng 2014 (C) Würth Elektronik; PARTNO: 68712414022
X2 = con-3m:2908-: 3M Card Connector microSD Normal Polarisation, Push-Push, Surface-Mount, 2900 Series 2908-05WB-MG: Surface mount, right angle Supplier: DigiKey 3M5607CT-ND Source: http://solutions.3m.com/wps/portal/3M/en_US/FP/FireProtection/Products/ProductCatalog/?PC_7_RJH9U5230GE3E02LECFTDQ0R92_nid=GGFDLLB87CbeGKZPW31NMHgl; PARTNO: 2908-05WB-MG
X3 = EAGLE-BOARD-TO-BOARD_CONNECTORS-rev16c:610X12243021: WR-PHD 2.54mm SMT Dual Socket Header Bottom Entry, 12 Pins=>Code : Con_BTB_SHD_2.54_2_610x12243021(packageing:x = 0: Tube x = 3: Tape & Reel with Cap) <http://katalog.we-online.de/media/images/eican/Con_BTB_SHD_2.54_2_6100xx243021_pf2.jpg> Details see: 6100xx243021 http://katalog.we-online.de/en/em/PHD_2_54_SMT_DUAL_SOCKET_HEADER_BOTTOM_ENTRY_6100XX243021 6103xx243021 http://katalog.we-online.de/en/em/PHD_2_54_SMT_DUAL_SOCKET_HEADER_BOTTOM_ENTRY_6103XX243021 2014 (C) Würth Elektronik; PARTNO: 517-153208-2020-TB
X4 = badge:JST-PH3

## Net classes
1 FAT: width 0.2 mm, drill 0.4 mm
2 GND/3V3: width 0.2 mm, drill 0.4 mm
3 Touch: width 0.2 mm, clearance 1 mm
4 touch prox: width 0.2 mm, clearance 1.6 mm